# Altium schematic sheet CONNECTOR.SchDoc
size A4
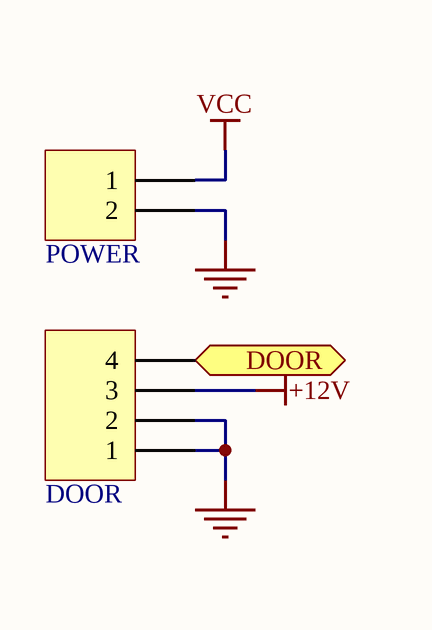
[diagram p0: CONNECTOR.SchDoc]

## Parts
DOOR  Header 4  [HX2.54-4]  (value not drawn)
POWER  Header 2  [HX2.54-2]  (value not drawn)

## Ports
DOOR (in)

## Nets
+12V: DOOR.3
GND: DOOR.1 DOOR.2 POWER.2
VCC: POWER.1
DOOR: DOOR.4 ; port DOOR

## Library data of the parts
DOOR = Header 4: Header, 4-Pin; LatestRevisionDate: 17-Jul-2002; LatestRevisionNote: Re-released for DXP Platform.; Publisher: Altium Limited
POWER = Header 2: Header, 2-Pin; LatestRevisionDate: 17-Jul-2002; LatestRevisionNote: Re-released for DXP Platform.; Publisher: Altium Limited